# EasyEDA schematic SCH_ExpansionModule.json
TITLE: CLController I/O Expansion Module; REV: 1.1; Date: 2022-08-17; Sheet: 1/1; Drawn By: Chris Brunner; Company: CyrusBuilt
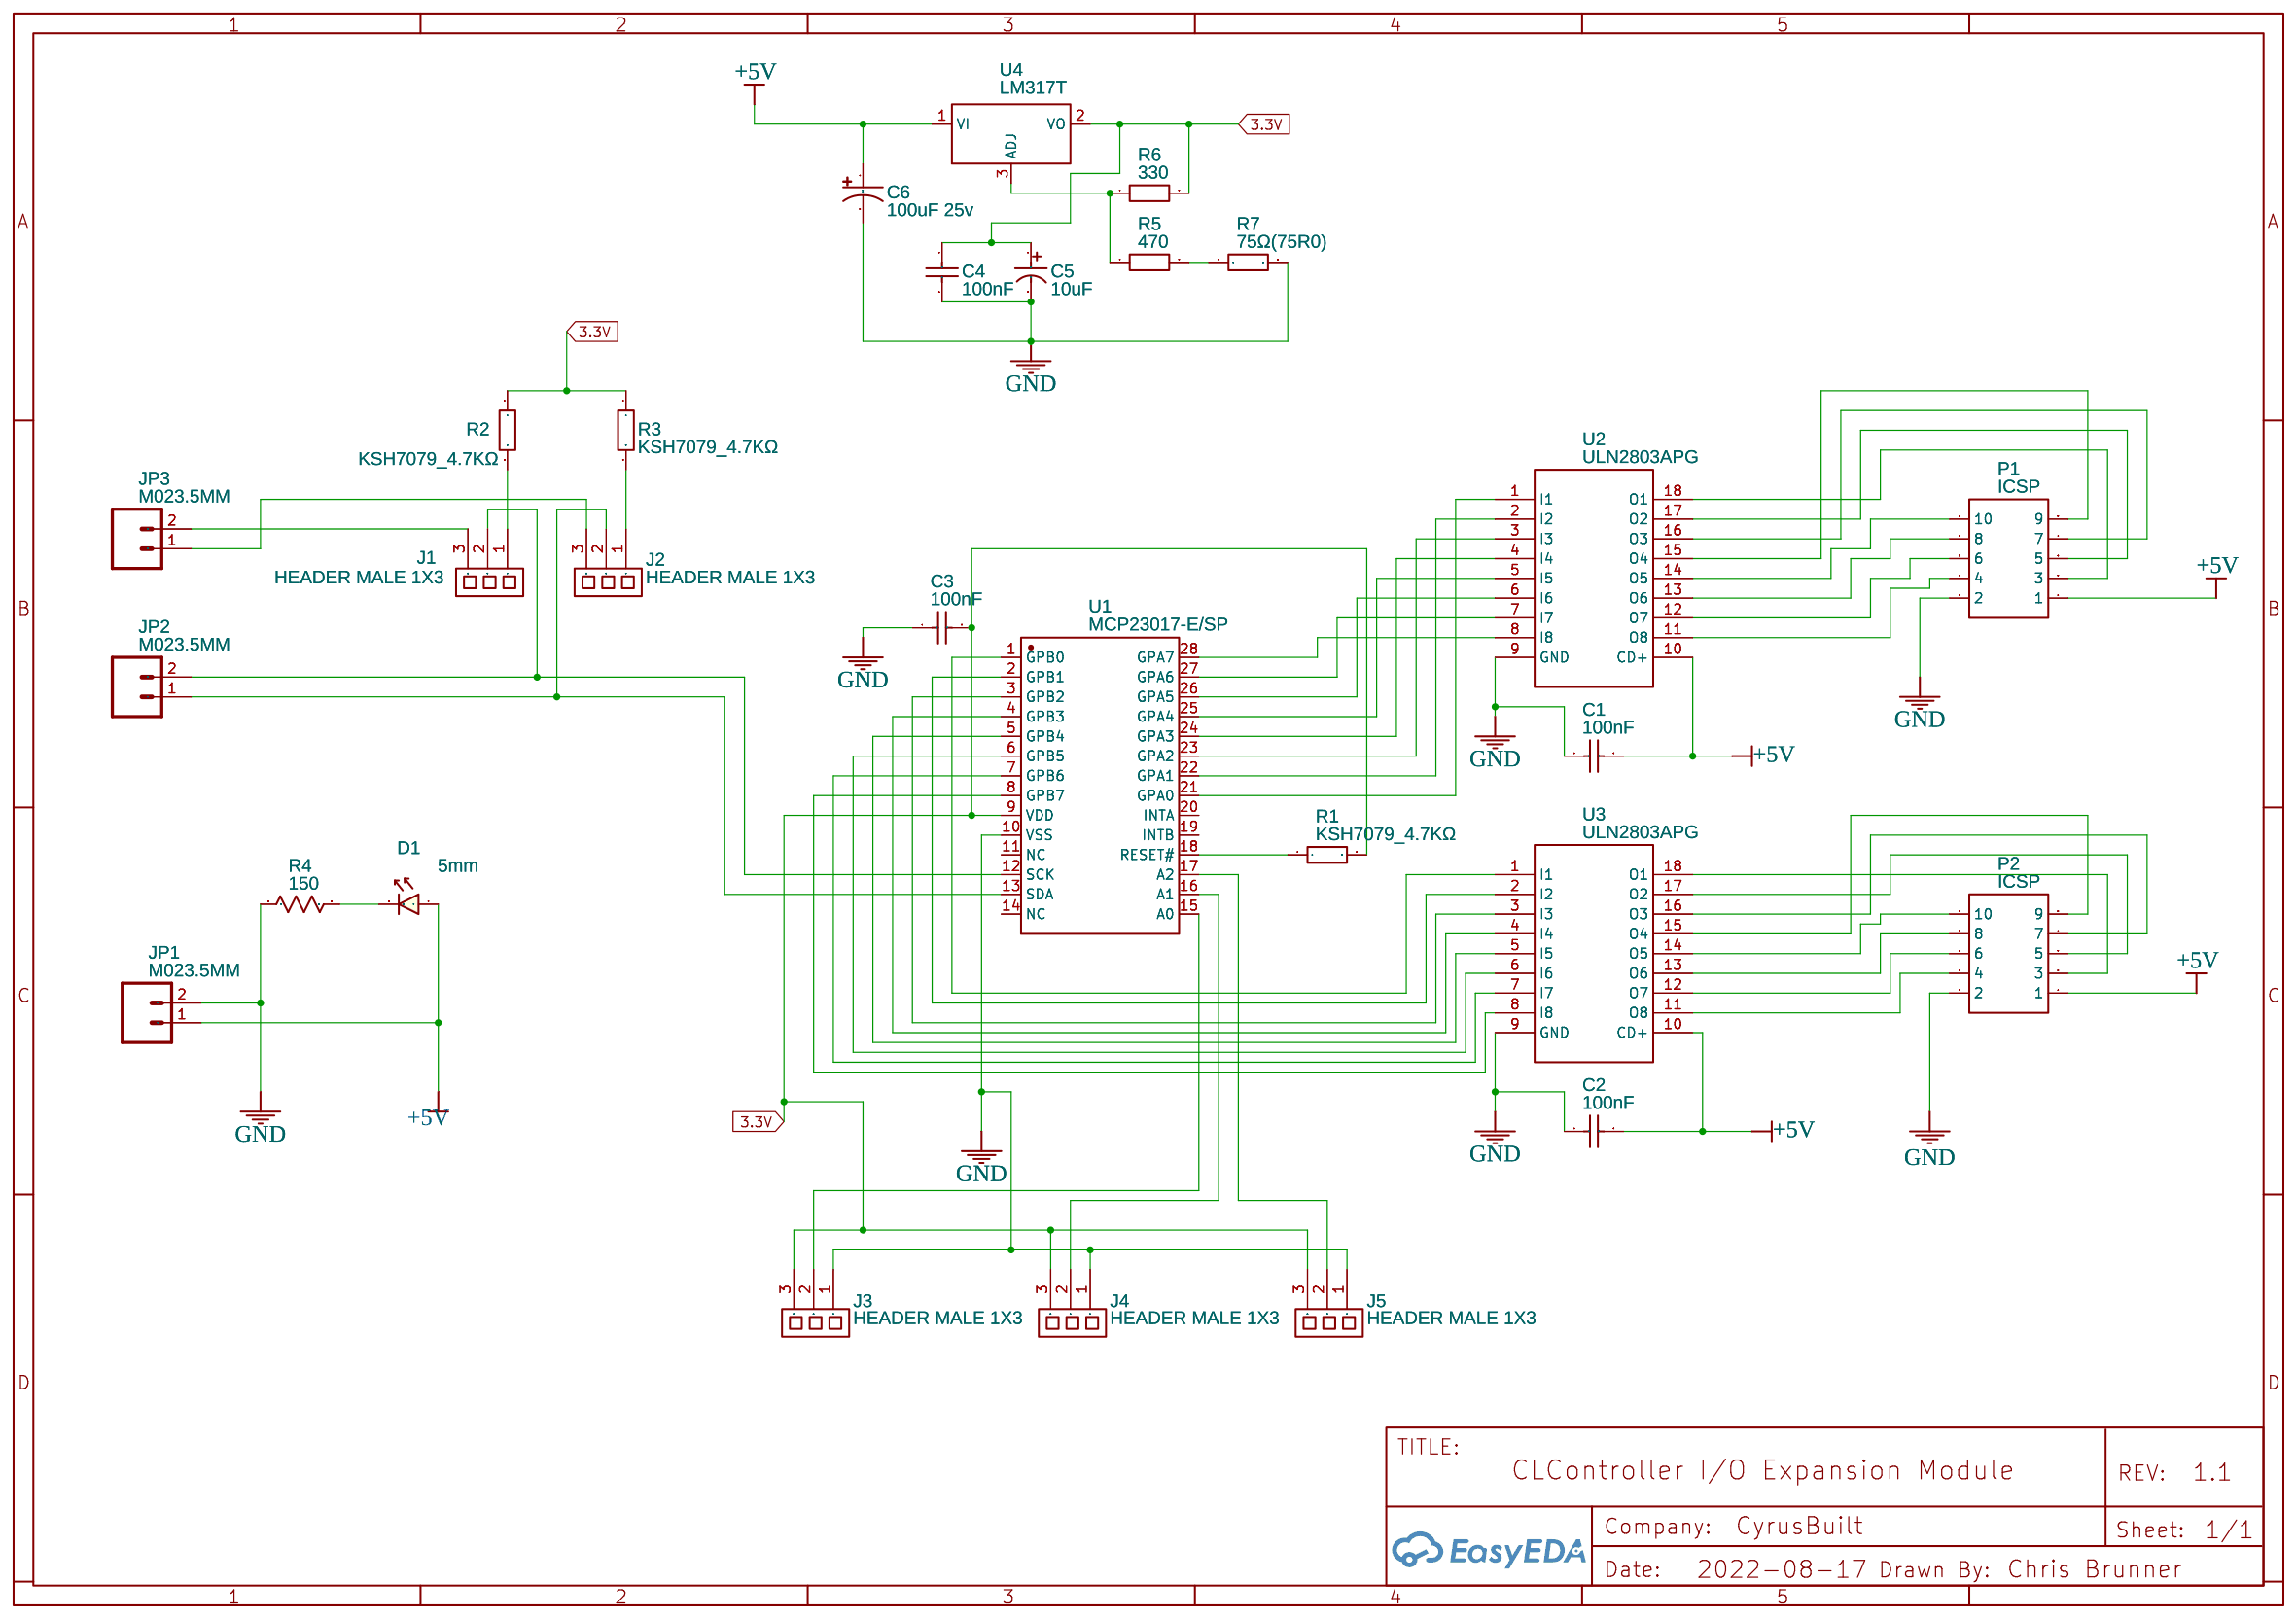
[diagram p0: schematic sheet]

## Parts
C1  100nF  [100NF]
C2  100nF  [100NF]
C3  100nF  [100NF]
C4  100nF  [100NF]
C5  10uF  [CAP-10UF-50V-CHONGX]
C6  100uF 25v  [100UF/25V]
D1  5mm  [PKG-LED-5MM-RED]
J1  HEADER MALE 1X3  [HEADER MALE OR FEMALE PINS 1X3]
J2  HEADER MALE 1X3  [HEADER MALE OR FEMALE PINS 1X3]
J3  HEADER MALE 1X3  [HEADER MALE OR FEMALE PINS 1X3]
J4  HEADER MALE 1X3  [HEADER MALE OR FEMALE PINS 1X3]
J5  HEADER MALE 1X3  [HEADER MALE OR FEMALE PINS 1X3]
JP1  M023.5MM  [SCREWTERMINAL-3.5MM-2]
JP2  M023.5MM  [SCREWTERMINAL-3.5MM-2]
JP3  M023.5MM  [SCREWTERMINAL-3.5MM-2]
P1  ICSP  [HDR-IDC-2.54-2X5P]
P2  ICSP  [HDR-IDC-2.54-2X5P]
R1  KSH7079_4.7KΩ  [KSH7079_4.7KR]
R2  KSH7079_4.7KΩ  [KSH7079_4.7KR]
R3  KSH7079_4.7KΩ  [KSH7079_4.7KR]
R4  150  [PKG-0.25W RESISTOR]
R5  470  [RESISTOR 1/4 WATT 470 OHM]
R6  330  [RESISTOR 1/4 WATT 330 OHM]
R7  75Ω(75R0)  [AXIAL-0.3]
U1  MCP23017-E/SP  [DIP-28_L35.0-W6.5-P2.54-LS7.6-BL]
U2  ULN2803APG  [ULN2803APG]
U3  ULN2803APG  [ULN2803APG]
U4  LM317T  [TO-220 (LM317T)]

## Library data of the parts
C1-C4 = 100nF: Supplier: LCSC; Manufacturer: ReliaPro; Manufacturer Part: CT4-0805Y104M500; Contributor: LCSC; Supplier Part: C46756
C5 = 10uF 50V ChongX: Supplier: LCSC; Manufacturer: ValuePro; Manufacturer Part: 10uF 50V白纸 13*25; Supplier Part: C43814; JLCPCB Part Class: Extended Part; Contributor: baongoc1234abcd
C6 = 100UF/25V: Contributor: dr.alex
D1 = RED LED: Color: Red; WaveLength: 617nm; Forward Voltage: 2.0V; Manufacturer: KINGBRIGHT; Manufacturer Part: L-1503EC; Supplier Part: 1003201; Supplier: Element14; link: http://www.farnell.com/datasheets/2046493.pdf?_ga=2.91228057.244688081.1505921947-238689616.1505921947&_gac=1.213042848.1505921947.EAIaIQobChMIsdP1s4y01gIVhxwbCh2_CAopEAAYASAAEgKnhPD_BwE; Contributor: Prof. Ing. F. Scordino
J1-J5 = HEADER MALE 1X3: Contributor: dardito2
JP1-JP3 = M023.5MM: Contributor: CNC Projects by Marcus Volk
P1 P2 = ICSP: Supplier: LCSC; Manufacturer: BOOMELE; Manufacturer Part: IDC Box 2.54mm 2X5P; image: //image.lceda.cn/szlcsc/C5665.jpg; Supplier Part: C5665; Contributor: NewburyPi
R1-R3 = KSH7079_4.7KΩ: Power: 1/4W; Tolerance: ±1%; EasyEDA: E57439; Supplier Part: E57439; Supplier: EasyEDA; Manufacturer: UniOhm; Manufacturer Part: MFR0W4F2200A50; Contributor: ksh7079
R4 = MCF 0.25W 150R: Power: 1/4W; Tolerance: ±5%; Supplier Part: 9339175; Supplier: Element14; Manufacturer: MULTICOMP; link: http://www.farnell.com/datasheets/2861447.pdf; Contributor: Prof. Ing. F. Scordino
R5 = 470: Contributor: Hendriyana
R6 = 330: Contributor: Hendriyana
R7 = MF1/8W-75Ω±1% T52: Supplier: LCSC; Manufacturer: CCO; Supplier Part: C119155
U1 = MCP23017-E/SP: Supplier: LCSC; Supplier Part: C647352; Manufacturer: Microchip Tech; Contributor: LCSC; JLCPCB Part Class: Extended Part
U2 U3 = ULN2803APG: Supplier: LCSC; Manufacturer: TOSHIBA; image: //image.lceda.cn/szlcsc/C5252.jpg; Supplier Part: C5252; Contributor: binhtq
U4 = LM317T: Supplier: Mouser; Manufacturer: ON; Supplier Part: 511-LM317T; Contributor: jboxeng

## Nets
3.3V: C3.2 C4.1 C5.1 J3.3 J4.3 J5.3 R1.2 R2.1 R3.1 R6.2 U1.9(VDD) U4.2(VO)
+5V: C1.2 C2.2 C6.1 D1.1 JP1.1 P1.1 P2.1 U2.10(CD+) U3.10(CD+) U4.1(VI)
GND: C1.1 C2.1 C3.1 C4.2 C5.2 C6.2 J3.1 J4.1 J5.1 JP1.2 P1.2 P2.2 R4.1 R7.2 U1.10(VSS) U2.9(GND) U3.9(GND)
Net-(D1-2): D1.2 R4.2
Net-(J1-1): J1.1 R2.2
Net-(J1-2): J1.2 JP2.2 U1.12(SCK)
Net-(J1-3): J1.3 JP3.2
Net-(J2-1): J2.1 R3.2
Net-(J2-2): J2.2 JP2.1 U1.13(SDA)
Net-(J2-3): J2.3 JP3.1
Net-(J3-2): J3.2 U1.15(A0)
Net-(J4-2): J4.2 U1.16(A1)
Net-(J5-2): J5.2 U1.17(A2)
Net-(P1-3): P1.3 U2.18(O1)
Net-(P1-4): P1.4 U2.11(O8)
Net-(P1-5): P1.5 U2.17(O2)
Net-(P1-6): P1.6 U2.12(O7)
Net-(P1-7): P1.7 U2.16(O3)
Net-(P1-8): P1.8 U2.13(O6)
Net-(P1-9): P1.9 U2.15(O4)
Net-(P1-10): P1.10 U2.14(O5)
Net-(P2-3): P2.3 U3.18(O1)
Net-(P2-4): P2.4 U3.11(O8)
Net-(P2-5): P2.5 U3.17(O2)
Net-(P2-6): P2.6 U3.12(O7)
Net-(P2-7): P2.7 U3.16(O3)
Net-(P2-8): P2.8 U3.13(O6)
Net-(P2-9): P2.9 U3.15(O4)
Net-(P2-10): P2.10 U3.14(O5)
Net-(R1-1): R1.1 U1.18(RESET#)
Net-(R5-1): R5.1 R6.1 U4.3(ADJ)
Net-(R5-2): R5.2 R7.1
Net-(U1-1): U1.1(GPB0) U3.1(I1)
Net-(U1-2): U1.2(GPB1) U3.2(I2)
Net-(U1-3): U1.3(GPB2) U3.3(I3)
Net-(U1-4): U1.4(GPB3) U3.4(I4)
Net-(U1-5): U1.5(GPB4) U3.5(I5)
Net-(U1-6): U1.6(GPB5) U3.6(I6)
Net-(U1-7): U1.7(GPB6) U3.7(I7)
Net-(U1-8): U1.8(GPB7) U3.8(I8)
Net-(U1-21): U1.21(GPA0) U2.1(I1)
Net-(U1-22): U1.22(GPA1) U2.2(I2)
Net-(U1-23): U1.23(GPA2) U2.3(I3)
Net-(U1-24): U1.24(GPA3) U2.4(I4)
Net-(U1-25): U1.25(GPA4) U2.5(I5)
Net-(U1-26): U1.26(GPA5) U2.6(I6)
Net-(U1-27): U1.27(GPA6) U2.7(I7)
Net-(U1-28): U1.28(GPA7) U2.8(I8)

Not connected (* = marked no-connect by the designer): U1 11(NC) 14(NC) 19(INTB) 20(INTA)
